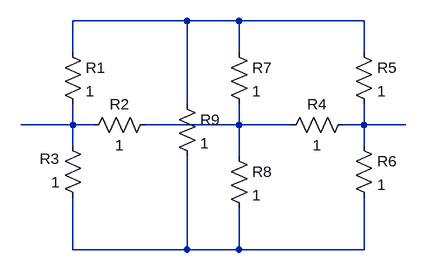
[diagram p0: schematic ex2.asc]
ex2.asc, the LTspice schematic file:
Version 4
SHEET 1 880 680
WIRE 224 64 48 64
WIRE 304 64 224 64
WIRE 496 64 304 64
WIRE 48 112 48 64
WIRE 304 112 304 64
WIRE 496 112 496 64
WIRE 224 192 224 64
WIRE 48 224 48 192
WIRE 48 224 -32 224
WIRE 80 224 48 224
WIRE 304 224 304 192
WIRE 304 224 160 224
WIRE 384 224 304 224
WIRE 496 224 496 192
WIRE 496 224 464 224
WIRE 560 224 496 224
WIRE 48 256 48 224
WIRE 496 256 496 224
WIRE 304 272 304 224
WIRE 48 416 48 336
WIRE 224 416 224 272
WIRE 224 416 48 416
WIRE 304 416 304 352
WIRE 304 416 224 416
WIRE 496 416 496 336
WIRE 496 416 304 416
SYMBOL res 32 96 R0
SYMATTR InstName R1
SYMATTR Value 1
SYMBOL res 176 208 R90
WINDOW 0 0 56 VBottom 2
WINDOW 3 32 56 VTop 2
SYMATTR InstName R2
SYMATTR Value 1
SYMBOL res 64 352 R180
WINDOW 0 36 76 Left 2
WINDOW 3 36 40 Left 2
SYMATTR InstName R3
SYMATTR Value 1
SYMBOL res 368 240 R270
WINDOW 0 32 56 VTop 2
WINDOW 3 0 56 VBottom 2
SYMATTR InstName R4
SYMATTR Value 1
SYMBOL res 480 96 R0
SYMATTR InstName R5
SYMATTR Value 1
SYMBOL res 480 240 R0
SYMATTR InstName R6
SYMATTR Value 1
SYMBOL res 288 96 R0
SYMATTR InstName R7
SYMATTR Value 1
SYMBOL res 288 256 R0
SYMATTR InstName R8
SYMATTR Value 1
SYMBOL res 208 176 R0
SYMATTR InstName R9
SYMATTR Value 1

The netlist it stands for:
* ex2.asc
R1 N001 N002 1
R2 N003 N002 1
R3 N005 N002 1
R4 N003 N004 1
R5 N001 N004 1
R6 N004 N005 1
R7 N001 N003 1
R8 N003 N005 1
R9 N001 N005 1
.backanno
.end